# EAGLE design WWV_Radio_V1_11 (EAGLE 6.6.0)
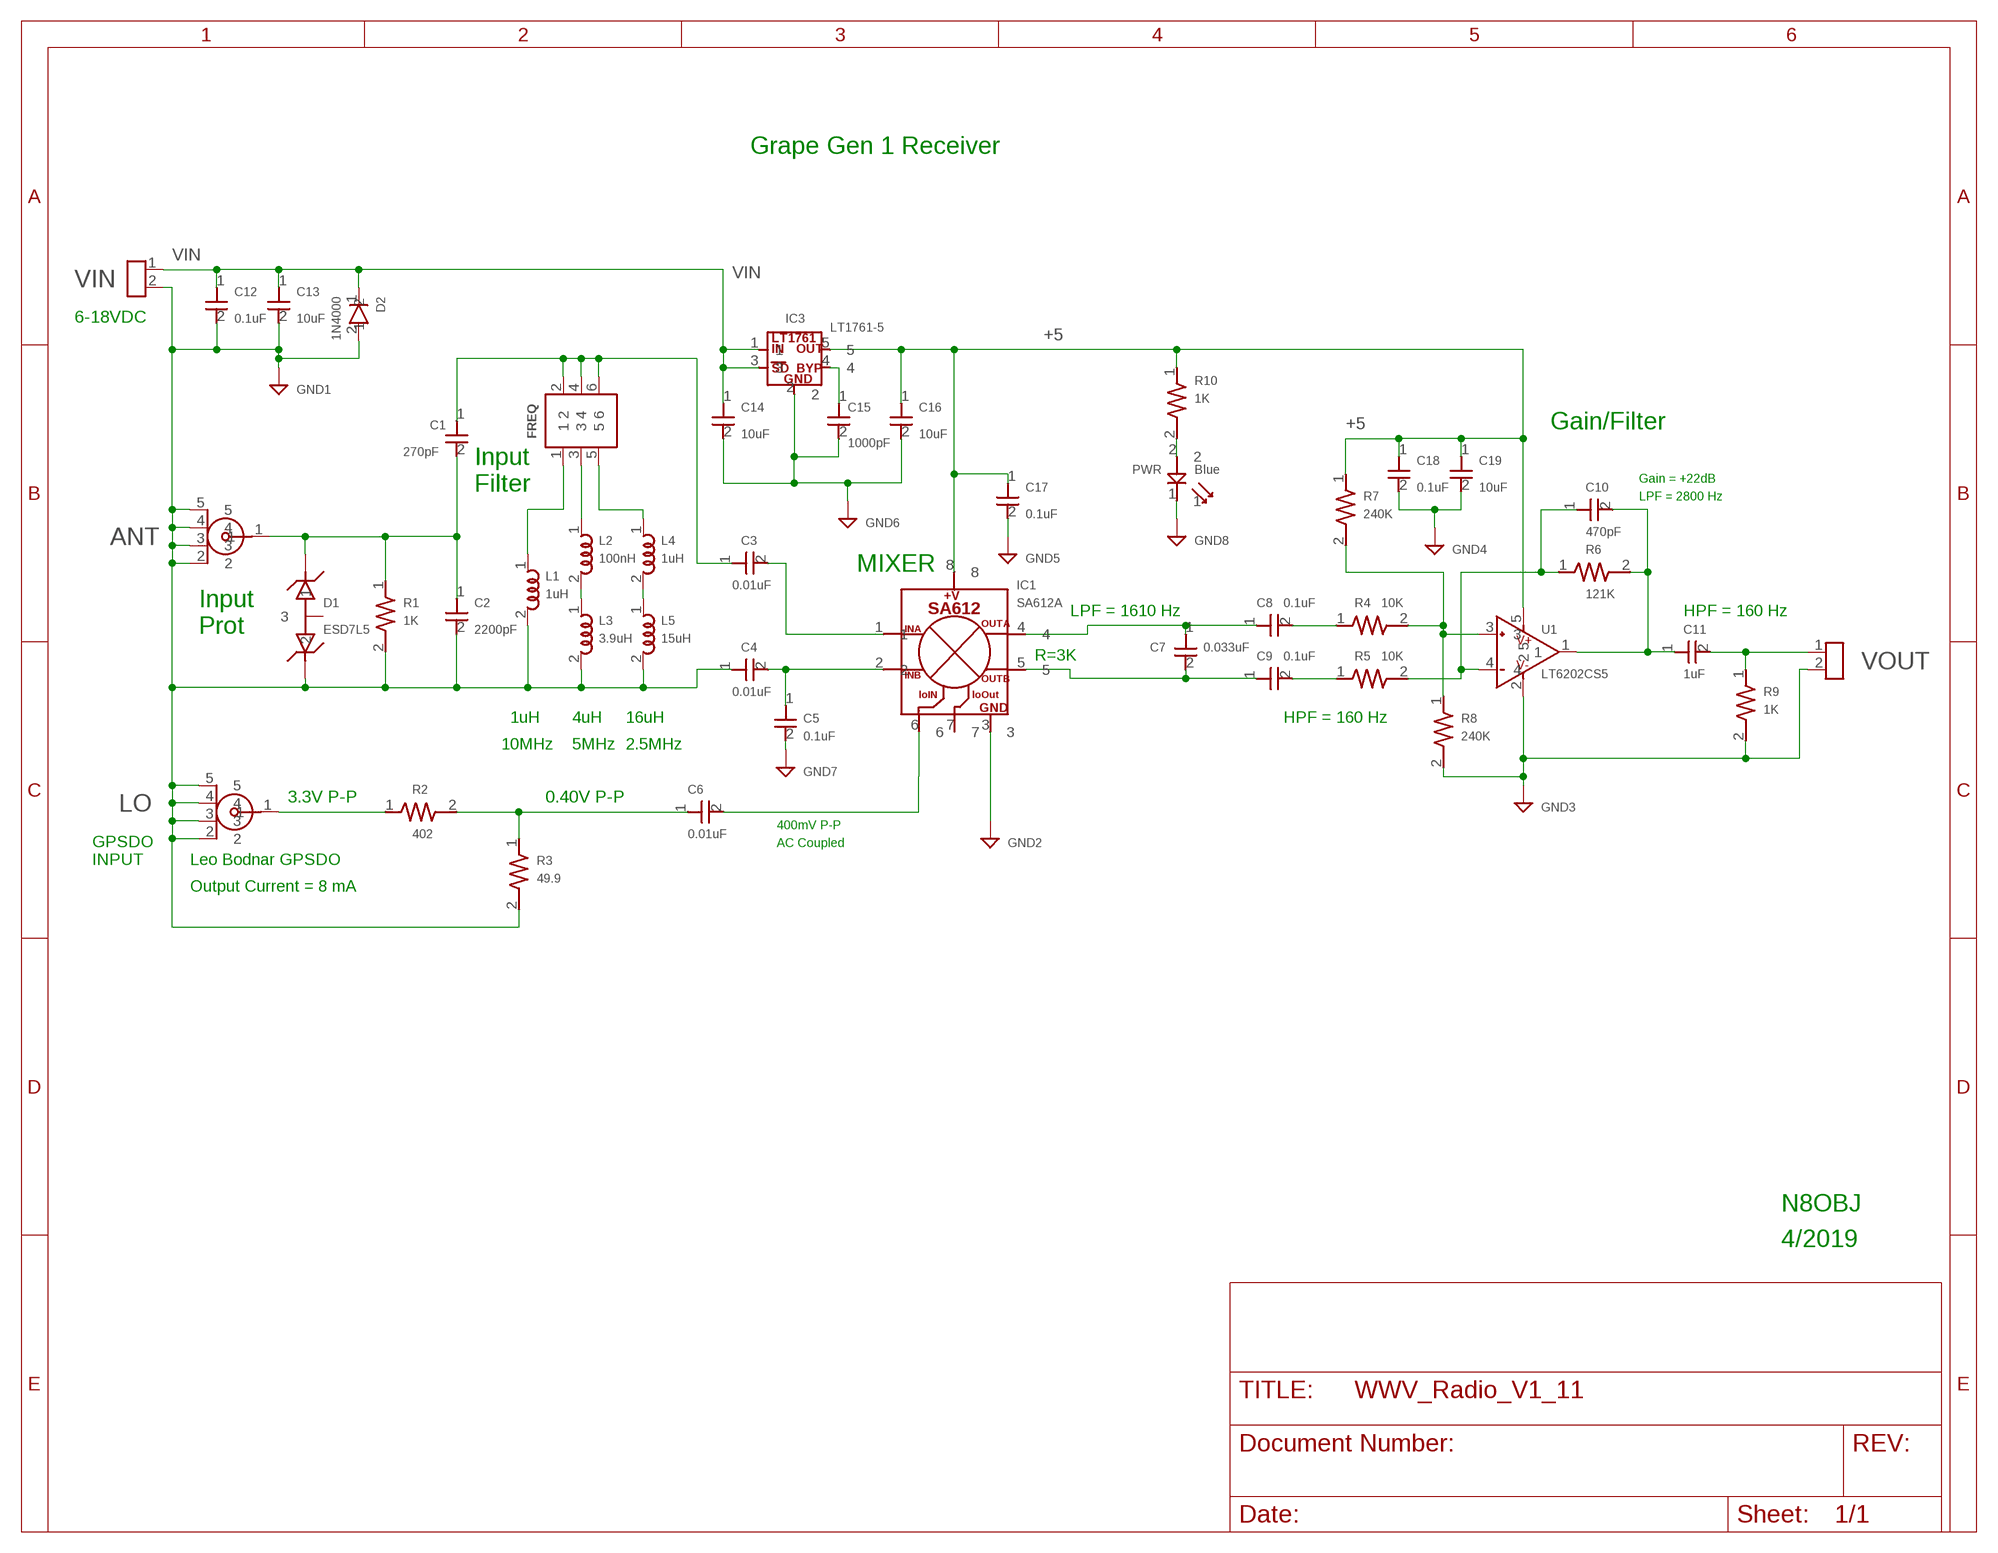
[diagram p0: schematic, sheet 1]

## Parts
ANT  SMAEDGEPCB  [SMAEDGEPCB]
C1  270pF  C0805  [C0805]
C2  2200pF  C0805  [C0805]
C3  0.01uF  C0805  [C0805]
C4  0.01uF  C0805  [C0805]
C5  0.1uF  C0805  [C0805]
C6  0.01uF  C0805  [C0805]
C7  0.033uF  C0805  [C0805]
C8  0.1uF  C0805  [C0805]
C9  0.1uF  C0805  [C0805]
C10  470pF  C0805  [C0805]
C11  1uF  C0805  [C0805]
C12  0.1uF  C0805  [C0805]
C13  10uF  C0805  [C0805]
C14  10uF  C0805  [C0805]
C15  1000pF  C0805  [C0805]
C16  10uF  C0805  [C0805]
C17  0.1uF  C0805  [C0805]
C18  0.1uF  C0805  [C0805]
C19  10uF  C0805  [C0805]
D1  ESD7L5  ESD7L  [ESD7L]
D2  1N4000  1N4000_PTH  [1N4000_PTH]
FREQ  2X3PINHEADER  [2X3PINHEADER]
IC1  SA612A  [SO08]
IC3  LT1761-5  LT1761-X  [TSOT-23]
L1  1uH  L1206  [R1206]
L2  100nH  L1206  [R1206]
L3  3.9uH  L1206  [R1206]
L4  1uH  L1206  [R1206]
L5  15uH  L1206  [R1206]
LO  SMAEDGEPCB  [SMAEDGEPCB]
PWR  Blue  LED0805  [LED0805]
R1  1K  R0805  [R0805]
R2  402  R0805  [R0805]
R3  49.9  R0805  [R0805]
R4  10K  R0805  [R0805]
R5  10K  R0805  [R0805]
R6  121K  R0805  [R0805]
R7  240K  R0805  [R0805]
R8  240K  R0805  [R0805]
R9  1K  R0805  [R0805]
R10  1K  R0805  [R0805]
U1  LT6202CS5  [SOT23_5]
VIN  2PINBERG  [2PINBERG]
VOUT  2PINBERG  [2PINBERG]

## Nets
+5: C16.1 C17.1 C18.1 C19.1 IC1.8 IC3.5 R7.1 R10.1 U1.5
GND: ANT.2 ANT.3 ANT.4 ANT.5 C2.2 C4.1 C5.2 C12.2 C13.2 C14.2 C15.2 C16.2 C17.2 C18.2 C19.2 D1.2 D2.2 IC1.3 IC3.2 L1.2 L3.2 L5.2 LO.2 LO.3 LO.4 LO.5 PWR.1 R1.2 R3.2 R8.2 R9.2 U1.2 VIN.2 VOUT.2
N$1: C10.1 R5.2 R6.1 U1.4
N$2: R4.2 R7.2 R8.1 U1.3
N$3: LO.1 R2.1
N$4: C8.2 R4.1
N$5: ANT.1 C1.2 C2.1 D1.1 R1.1
N$6: L4.2 L5.1
N$7: C4.2 C5.1 IC1.2
N$8: C7.1 C8.1 IC1.4
N$9: C7.2 C9.1 IC1.5
N$10: C6.1 R2.2 R3.1
N$11: C10.2 C11.1 R6.2 U1.1
N$12: C15.1 IC3.4
N$13: C9.2 R5.1
N$14: C3.2 IC1.1
N$15: C1.1 C3.1 FREQ.2 FREQ.4 FREQ.6
N$16: L2.2 L3.1
N$17: C11.2 R9.1 VOUT.1
N$18: PWR.2 R10.2
N$19: FREQ.1 L1.1
N$20: FREQ.3 L2.1
N$21: FREQ.5 L4.1
N$22: C6.2 IC1.6
VIN: C12.1 C13.1 C14.1 D2.1 IC3.1 IC3.3 VIN.1
Unconnected: D1.3 IC1.7

## Notes on the sheet
- Grape Gen 1 Receiver
- 6-18VDC
- Gain/Filter
- Input
- Gain = +22dB
- Filter
- LPF = 2800 Hz
- MIXER
- Input
- LPF = 1610 Hz | HPF = 160 Hz
- Prot
- R=3K
- 1uH | 4uH | 16uH | HPF = 160 Hz
- 10MHz | 5MHz | 2.5MHz
- 3.3V P-P | 0.40V P-P
- 400mV P-P
- GPSDO | AC Coupled
- INPUT | Leo Bodnar GPSDO
- Output Current = 8 mA
- N8OBJ
- 4/2019

## Library data of the parts
ANT LO = JCGCustom:SMAEDGEPCB
C1-C19 = JCGCustom:C0805
D1 = JCGCustom:ESD7L
D2 = JCGCustom:1N4000_PTH
FREQ = JCGCustom:2X3PINHEADER
IC1 = JCGCustom:SA612A: SA612A is a low-power VHF monolithic double-balanced mixer with on-board oscillator and voltage regulator
IC3 = JCGCustom:LT1761-X: LT1761-X Fixed V LDO
L1-L5 = JCGCustom:L1206
PWR = JCGCustom:LED0805
R1-R10 = JCGCustom:R0805
U1 = JCGCustom:LT6202CS5: LT6202CS5 O/A SOT23_5
VIN VOUT = JCGCustom:2PINBERG

## Board
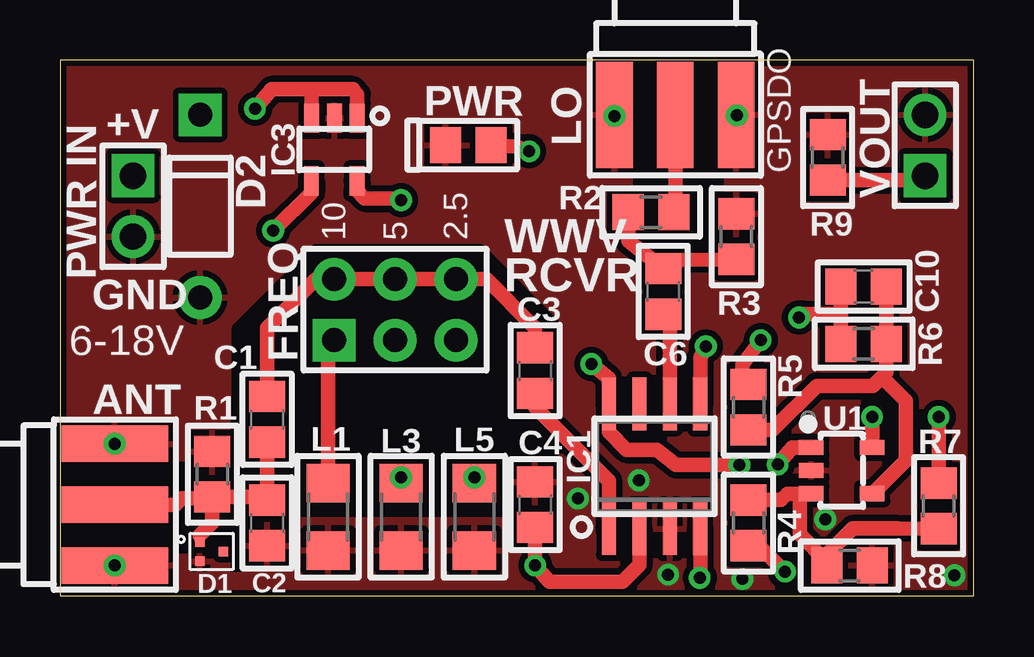
[diagram p1: board, top side]
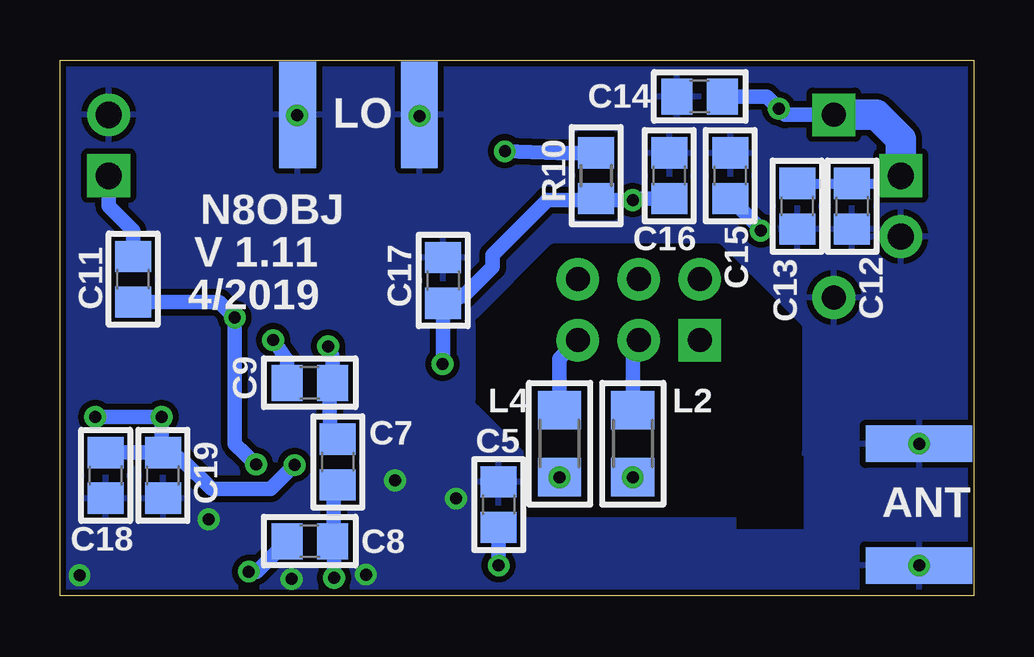
[diagram p2: board, bottom side, seen from below]

Size 38.1 x 22.35 mm. Coordinates in mm from the lower left corner, seen from the top.
Outline: 0,0 38.1,0 38.1,22.35 0,22.35 0,0
Copper layers (1*16): Top 0.035mm / dielectric 1.5mm / Bottom 0.035mm
Design rules "default *": minimum track width 10mil, minimum drill 19mil, track to track 10mil, track to pad 10mil, pad to pad 10mil, via to via 10mil, smd to smd 10mil, copper to edge 10mil, drill to drill 8mil, minimum pad ring 10mil, minimum via ring 8mil, stop-mask expansion 4mil, vias tented up to drill 0mil, thermal gap 10mil
tRestrict: area 0,4.6 to 5.6,5.6; area 0,2 to 5.3,3; area 7.1,1 to 7.6,7.4; area 7.4,5.8 to 20.6,14.5; area 7.4,3.3 to 18.8,5.8; area 4.6,1.8 to 5.6,2; area 9.4,2.8 to 9.9,3.3; area 23.9,14.2 to 27.7,22.4
bRestrict: area 7.4,5.8 to 20.6,14.5; area 7.1,3.3 to 18.8,5.8; area 7.1,2.8 to 9.9,3.3

### Footprints (pad centres in the part's own frame; a part is rotated, then mirrored left to right if it is on the bottom)
SMAEDGEPCB = smd 4.445 x 1.524: 1 2.286,0; 2 2.286,2.54; 3 2.286,-2.54 | smd 4.445 x 1.524 bottom: 4 2.286,2.54; 5 2.286,-2.54
C0805 = smd 1.3 x 1.5: 1 -0.95,0; 2 0.95,0
ESD7L = smd 0.399 x 0.399: 1 -0.399,-0.495; 2 0.399,-0.495; 3 0,0.495
1N4000_PTH = drill 1 pad 1.778 square: 1 -3.81,0 | drill 1 pad 1.778: 2 3.81,0
2X3PINHEADER = drill 1 pad 1.778 square: 1 -1.27,2.54 | drill 1 pad 1.778: 2 1.27,2.54; 3 -1.27,0; 4 1.27,0; 5 -1.27,-2.54; 6 1.27,-2.54
SO08 = smd 2.2 x 0.6: 1 -2.6,1.905; 2 -2.6,0.635; 3 -2.6,-0.635; 4 -2.6,-1.905; 5 2.6,-1.905; 6 2.6,-0.635; 7 2.6,0.635; 8 2.6,1.905
TSOT-23 = smd 0.62 x 1.22: 1 -0.96,-1.31; 2 -0.01,-1.31; 3 0.94,-1.31; 4 0.95,1.31; 5 -0.95,1.31
R1206 = smd 1.6 x 1.8: 1 -1.4,0; 2 1.4,0
LED0805 = smd 1.3 x 1.5: 1 -0.95,0; 2 0.95,0
R0805 = smd 1.3 x 1.5: 1 -0.95,0; 2 0.95,0
SOT23_5 = smd 0.635 x 1.016: 1 -0.965,-1.27; 2 0,-1.27; 3 0.965,-1.27; 4 0.965,1.27; 5 -0.965,1.27
2PINBERG = drill 1.1 pad 1.778 square: 1 0,1.27 | drill 1.1 pad 1.778: 2 0,-1.27

### Placement (x,y rotation side)
ANT  0,3.81 0 top
C1  8.64,7.37 270 top
C2  8.64,3.05 270 top
C3  19.81,9.4 270 top
C4  19.81,3.81 270 top
C5  19.81,3.81 90 bottom
C6  25.15,12.7 270 top
C7  26.52,5.59 90 bottom
C8  27.69,2.29 180 bottom
C9  27.69,8.89 180 bottom
C10  33.5,12.9 180 top
C11  35.05,13.21 90 bottom
C12  5.08,16.26 270 bottom
C13  7.37,16.26 270 bottom
C14  11.43,20.83 180 bottom
C15  10.16,17.53 90 bottom
C16  12.7,17.53 90 bottom
C17  22.12,13.16 90 bottom
C18  36.2,5.03 270 bottom
C19  33.81,5.03 270 bottom
D1  6.32,1.85 270 top
D2  5.84,16.26 270 top
FREQ  13.97,11.94 90 top
IC1  24.79,5.41 90 top
IC3  11.43,18.62 180 top
L1  11.18,3.3 270 top
L2  14.22,6.35 270 bottom
L3  14.22,3.3 270 top
L4  17.27,6.35 270 bottom
L5  17.27,3.3 270 top
LO  25.65,22.35 270 top
PWR  17.02,18.8 0 top
R1  6.35,5.08 90 top
R2  24.64,16 180 top
R3  28.19,14.99 90 top
R4  28.7,3.05 90 top
R5  28.7,7.87 270 top
R6  33.5,10.52 180 top
R7  36.63,3.76 270 top
R8  32.92,1.27 0 top
R9  32,18.29 90 top
R10  15.75,17.53 90 bottom
U1  32.59,5.23 270 top
VIN  3.05,16.26 0 top
VOUT  36.07,18.8 180 top

### Tracks (layer width: path | path; a pad name or v marks a point on that pad's centre or on a via)
+5  (via drill 0.5)
  Top 0.61: IC3.5 12.38,16.9 C16.1 14.16,16.58 v14.22,16.51 | v22.15,9.68 22.89,9.08 IC1.8 22.89,6.83 23.62,6.1 24.89,6.1 25.68,5.46 v28.32,5.46 | v33.86,7.47 U1.5 | R7.1 v36.63,7.47
  Bottom 0.61: v14.22,16.51 15.68,16.51 R10.1 | C16.1 14.16,16.58 v14.22,16.51 | v14.22,16.51 17.78,16.51 20.07,14.22 20.07,13.72 21.27,12.51 C17.1 22.12,9.75 v22.15,9.68 | C18.1 C19.1 33.86,6.31 | 33.86,6.31 32.97,5.64 31.77,4.47 29.31,4.47 v28.32,5.46 | 33.86,6.31 v33.86,7.47 v36.63,7.47
GND  (via drill 0.5)
  other vias: 21.59,4.06 31.9,3.2 2.29,1.27 2.29,6.35 24.13,4.83 28.45,0.71 25.35,0.89 23.11,20.02 28.22,20.04 37.29,0.86
  pour Top: 0.25,22.1 0.25,0.25 37.85,0.25 37.85,22.1
  pour Bottom: 0.25,0.25 37.85,0.25 37.85,22.1 0.25,22.1
N$1
  Top 0.61: R5.2 29.71,6.92 31.55,8.76 33.88,8.76 34.25,9.13 | 34.25,9.13 34.44,9.32 34.44,10.51 R6.1 C10.1 | U1.4 35.26,5.66 35.26,8.13 34.25,9.13
N$2
  Top 0.61: R4.2 30.06,4 30.33,4.27 30.81,4.27 | 30.81,4.27 U1.3 | 30.81,4.27 30.84,4.24 30.84,2.56 31.97,1.43 R8.1 32.05,1.36 32.05,1.83 33.05,2.82 34.92,2.82 36.08,2.81 R7.2
N$3
  Top 0.61: LO.1 25.65,16.07 R2.1
N$4  (via drill 0.5)
  Top 0.61: R4.1 28.7,2.22 C8.2 28.96,2.29 v30.23,1.02
  Bottom 0.61: v30.23,1.02 29.91,1.02 C8.2
N$5
  Top 0.406: 8.76,4.13 C2.1 | D1.1 5.83,2.53
  Top 0.61: R1.1 8.76,4.13 | C2.1 C1.2 | ANT.1 4.83,3.81 5.08,4.06 6.28,4.06 R1.1 | 5.83,2.53 6.35,3.05 R1.1
N$6  (via drill 0.5)
  Top 0.61: L5.1 L4.2
  other vias: 17.27,4.95
N$7  (via drill 0.5)
  Top 0.61: IC1.2 24.16,1.29 23.44,0.58 20.4,0.58 v19.81,1.27 C4.2
  Bottom 0.61: C4.2 v19.81,1.27
N$8  (via drill 0.5)
  Top 0.61: v26.67,0.76 26.7,0.79 IC1.4
  Bottom 0.61: C7.1 26.7,4.18 IC1.4 | IC1.4 26.74,2.77 C8.1 | IC1.4 26.67,2.79 v26.67,0.76
N$9  (via drill 0.5)
  Top 0.61: IC1.5 26.7,9.93 v26.92,10.41
  Bottom 0.61: C7.2 26.85,6.86 26.86,8.22 C9.1 26.74,9.97 v26.92,10.41
N$10
  Top 0.61: R3.1 25.88,14.01 C6.1 23.69,14.8 R2.2
N$11  (via drill 0.5)
  Top 0.61: U1.1 30.53,6.2 v29.92,5.49 | R6.2 32.55,11.76 | 32.55,11.76 C10.2 | v30.81,11.61 30.96,11.76 32.55,11.76
  Bottom 0.61: C11.1 31.46,12.26 v30.81,11.61 30.81,6.35 v29.92,5.49
N$12  (via drill 0.5)
  Top 0.61: IC3.4 10.48,16.83 v8.89,15.24
  Bottom 0.61: v8.89,15.24 8.89,15.31 C15.1
N$13  (via drill 0.5)
  Top 0.61: v29.21,10.67 28.45,9.65 28.45,9.08 R5.1
  Bottom 0.61: C9.2 28.64,9.84 v29.21,10.67
N$14
  Top 0.61: C3.2 19.81,7.87 22.89,4.8 IC1.1
N$15
  Top 0.61: C3.1 19.81,11.18 17.78,13.21 FREQ.6 FREQ.4 FREQ.2 10.67,13.21 8.64,11.18 C1.1
N$16  (via drill 0.5)
  Top 0.61: L3.1 L2.2
  other vias: 14.22,4.95
N$17
  Top 0.61: R9.1 35.88,17.34 VOUT.1
  Bottom 0.61: C11.2 35.05,15.24 36.07,16.26 VOUT.1
N$18  (via drill 0.5)
  Top 0.61: v19.56,18.54 19.05,18.73 PWR.2
  Bottom 0.61: R10.2 17.34,18.48 v19.56,18.54
N$19
  Top 0.61: L1.1 11.18,10.41 FREQ.1
N$20
  Bottom 0.61: L2.1 14.22,10.41 FREQ.3
N$21
  Bottom 0.61: L4.1 17.27,9.91 FREQ.5
N$22
  Top 0.61: IC1.6 25.43,11.47 C6.2
VIN  (via drill 0.5)
  Top 0.61: IC3.1 12.39,20.91 12.22,21.13 10.49,21.13 | 10.49,21.13 10.49,20.23 IC3.3 | 10.49,21.13 8.81,21.13 v8.13,20.32
  Bottom 0.406: C13.1 C12.1 3.37,17.21 VIN.1
  Bottom 0.61: D2.1 7.87,20.07 v8.13,20.32 8.64,20.83 C14.1
  Bottom 1.27: D2.1 4.06,20.07 3.05,19.05 VIN.1

### Text on the board
tPlace: +V | LO | GPSDO | 10 | 5 | 2.5 | WWV | PWR IN | RCVR | GND | 6-18V
bPlace: N8OBJ | V 1.11 | 4/2019 | ANT